# EAGLE design VU_Meter_Featherwing (EAGLE 9.5.0)
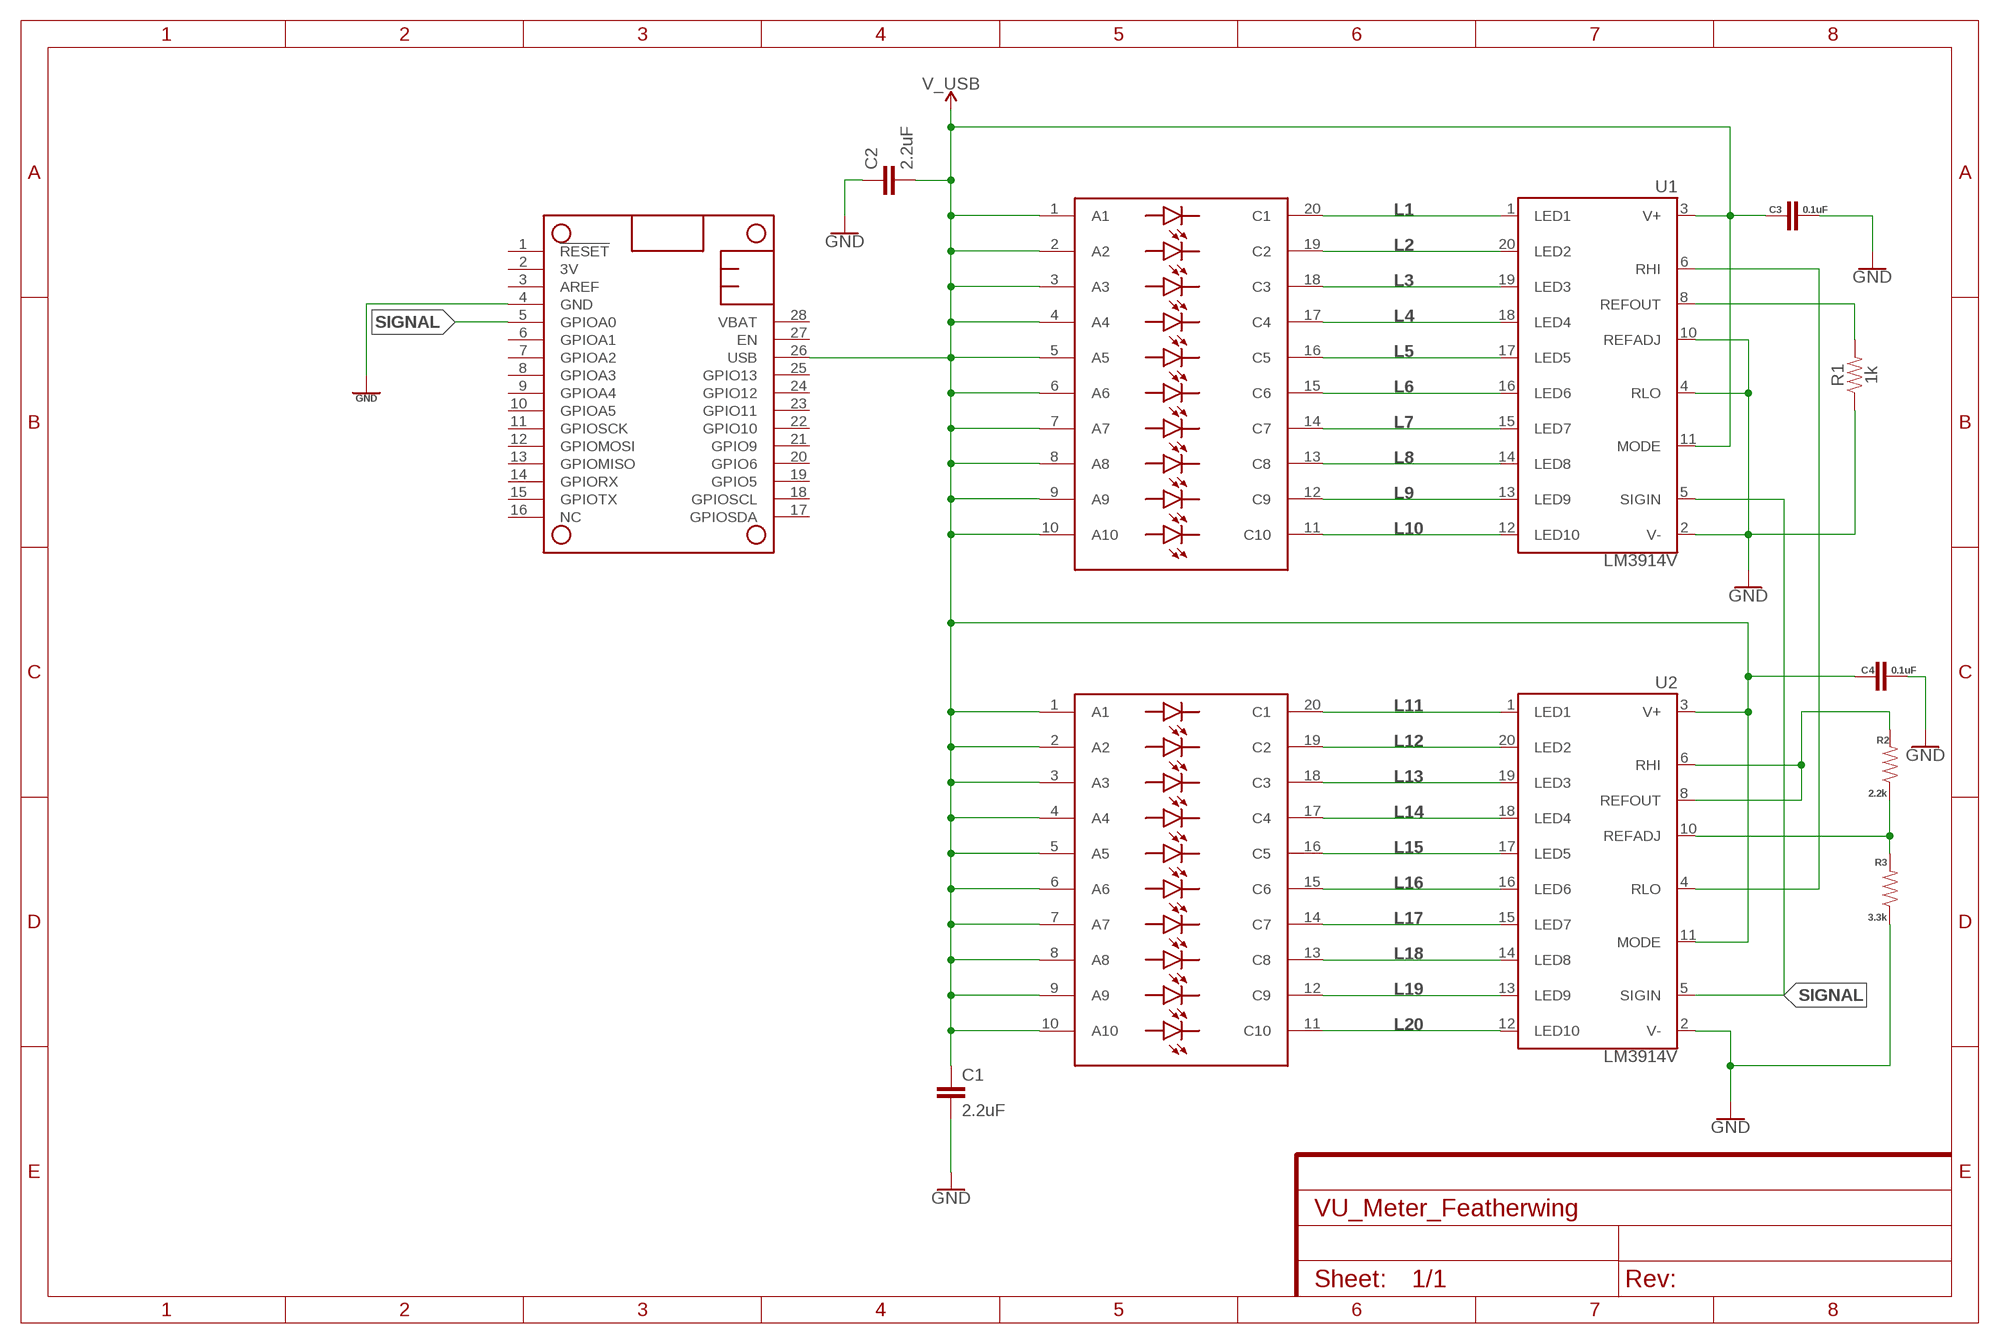
[diagram p0: schematic, sheet 1]

## Parts
C1  2.2uF  2.2UF-0603-10V-20%  [0603]
C2  2.2uF  2.2UF-0603-10V-20%  [0603]
C3  0.1uF  0.1UF-0603-25V-(+80/-20%)  [0603]
C4  0.1uF  0.1UF-0603-25V-(+80/-20%)  [0603]
MS1  FEATHERWINGBAR_GRAPH  [FEATHERWING_BAR]
R1  1k  1KOHM-0603-1/10W-1%  [0603]
R2  2.2k  2.2KOHM-0603-1/10W-1%  [0603]
R3  3.3k  3.3KOHM-0603-1/10W-1%  [0603]
U1  LM3914V  [PLCC20S]
U2  LM3914V  [PLCC20S]
U$1  BAR_GRAPHSMD-BARGRAPH  [3104310541105000]
U$2  BAR_GRAPHSMD-BARGRAPH  [3104310541105000]

## Nets
GND: C1.2 C2.1 C3.2 C4.2 MS1.4(GND) R1.1 R3.1 U1.2(V-) U1.4(RLO) U1.10(REFADJ) U2.2(V-)
L1: U1.1(LED1) U$1.20(C1)
L2: U1.20(LED2) U$1.19(C2)
L3: U1.19(LED3) U$1.18(C3)
L4: U1.18(LED4) U$1.17(C4)
L5: U1.17(LED5) U$1.16(C5)
L6: U1.16(LED6) U$1.15(C6)
L7: U1.15(LED7) U$1.14(C7)
L8: U1.14(LED8) U$1.13(C8)
L9: U1.13(LED9) U$1.12(C9)
L10: U1.12(LED10) U$1.11(C10)
L11: U2.1(LED1) U$2.20(C1)
L12: U2.20(LED2) U$2.19(C2)
L13: U2.19(LED3) U$2.18(C3)
L14: U2.18(LED4) U$2.17(C4)
L15: U2.17(LED5) U$2.16(C5)
L16: U2.16(LED6) U$2.15(C6)
L17: U2.15(LED7) U$2.14(C7)
L18: U2.14(LED8) U$2.13(C8)
L19: U2.13(LED9) U$2.12(C9)
L20: U2.12(LED10) U$2.11(C10)
N$2: R1.2 U1.8(REFOUT)
N$4: R2.1 R3.2 U2.10(REFADJ)
N$5: R2.2 U2.6(RHI) U2.8(REFOUT)
REF: U1.6(RHI) U2.4(RLO)
SIGNAL: MS1.5(GPIOA0) U1.5(SIGIN) U2.5(SIGIN)
V_USB: C1.1 C2.2 C3.1 C4.1 MS1.26(USB) U1.3(V+) U1.11(MODE) U2.3(V+) U2.11(MODE) U$1.1(A1) U$1.2(A2) U$1.3(A3) U$1.4(A4) U$1.5(A5) U$1.6(A6) U$1.7(A7) U$1.8(A8) U$1.9(A9) U$1.10(A10) U$2.1(A1) U$2.2(A2) U$2.3(A3) U$2.4(A4) U$2.5(A5) U$2.6(A6) U$2.7(A7) U$2.8(A8) U$2.9(A9) U$2.10(A10)
Unconnected: MS1.1(!RESET) MS1.2(3V) MS1.3(AREF) MS1.6(GPIOA1) MS1.7(GPIOA2) MS1.8(GPIOA3) MS1.9(GPIOA4) MS1.10(GPIOA5) MS1.11(GPIOSCK) MS1.12(GPIOMOSI) MS1.13(GPIOMISO) MS1.14(GPIORX) MS1.15(GPIOTX) MS1.16(NC) MS1.17(GPIOSDA) MS1.18(GPIOSCL) MS1.19(GPIO5) MS1.20(GPIO6) MS1.21(GPIO9) MS1.22(GPIO10) MS1.23(GPIO11) MS1.24(GPIO12) MS1.25(GPIO13) MS1.27(EN) MS1.28(VBAT)

## Library data of the parts
C1 C2 = SparkFun-Capacitors:2.2UF: 2.2µF ceramic capacitors A capacitor is a passive two-terminal electrical component used to store electrical energy temporarily in an electric field.; PROD_ID: CAP-07888
C3 C4 = SparkFun-Capacitors:0.1UF: 0.1µF ceramic capacitors A capacitor is a passive two-terminal electrical component used to store electrical energy temporarily in an electric field.; PROD_ID: CAP-00810
MS1 = adafruit:FEATHERWING
R1 = SparkFun-Resistors:1KOHM: 1kΩ resistor A resistor is a passive two-terminal electrical component that implements electrical resistance as a circuit element. Resistors act to reduce current flow, and, at the same time, act to lower voltage levels within circuits. - Wikipedia; PROD_ID: RES-07856
R2 = SparkFun-Resistors:2.2KOHM: 2.2kΩ resistor A resistor is a passive two-terminal electrical component that implements electrical resistance as a circuit element. Resistors act to reduce current flow, and, at the same time, act to lower voltage levels within circuits. - Wikipedia; PROD_ID: RES-08272
R3 = SparkFun-Resistors:3.3KOHM: 3.3kΩ resistor A resistor is a passive two-terminal electrical component that implements electrical resistance as a circuit element. Resistors act to reduce current flow, and, at the same time, act to lower voltage levels within circuits. - Wikipedia; PROD_ID: RES-07851
U1 U2 = SparkFun-IC-Special-Function:LM391: LM3914 Dot/Bar Display Driver TTL/CMOS Logic Drives LEDs, LCDs, Vacuum Fluorecents Source: Data sheet LM3915 <http://www.national.com/ds/LM/LM3915.pdf> Data sheet LM3914 <http://www.national.com/ds/LM/LM3914.pdf> SparkFun Products: MyoWare LED Shield <https://www.sparkfun.com/products/13688> Dot/Bar Display Driver - LM3914 <https://www.sparkfun.com/products/12694>; PROD_ID: IC-13110
U$1 U$2 = bar-grph:BAR_GRAPH

## Board
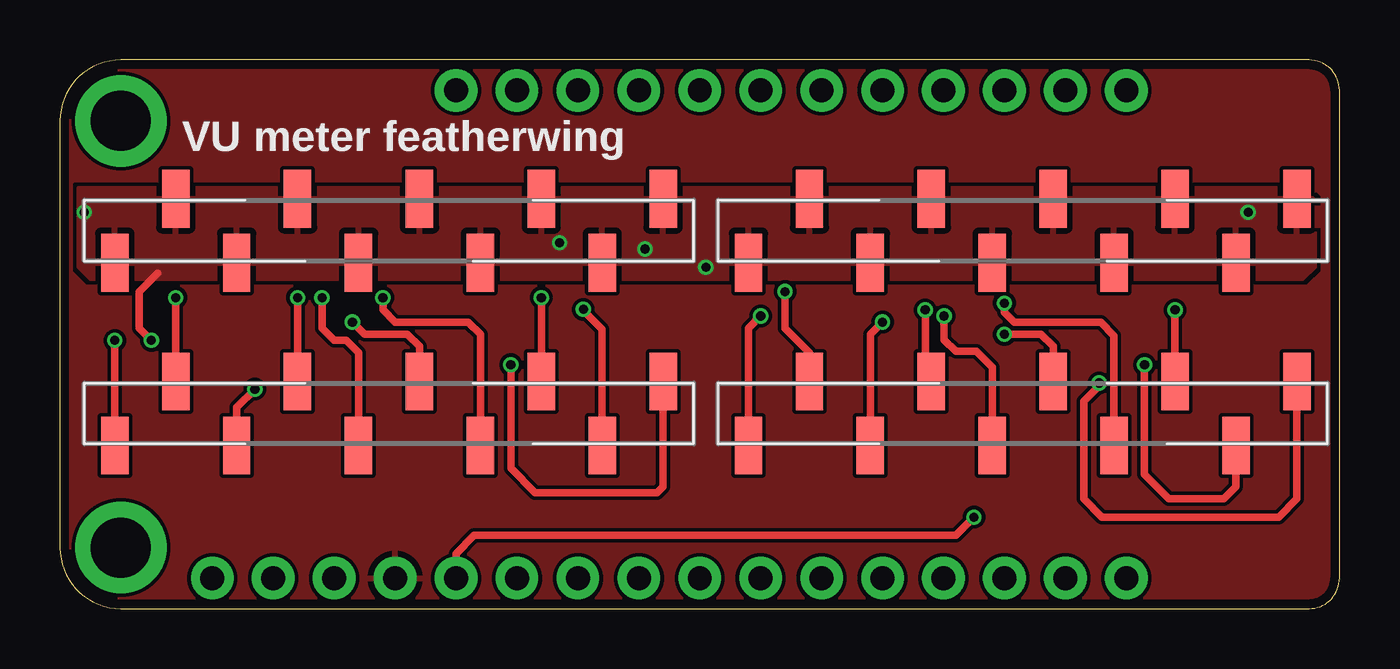
[diagram p1: board, top side]
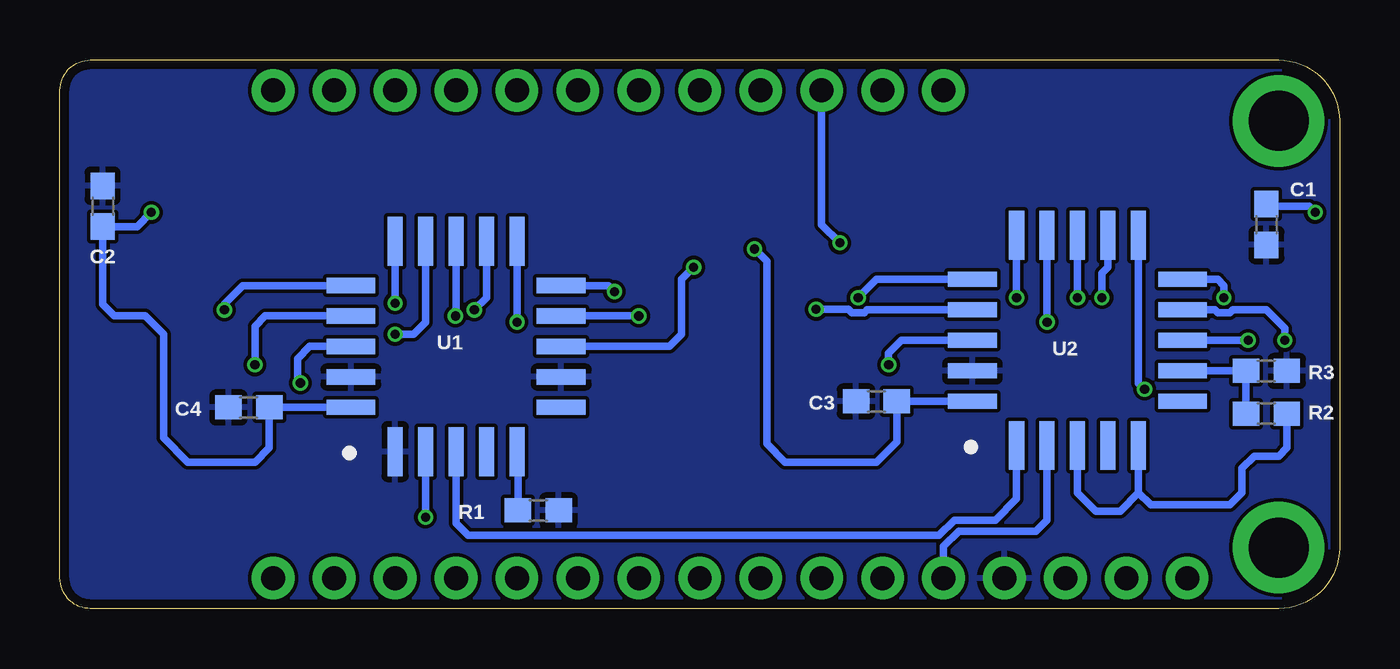
[diagram p2: board, bottom side, seen from below]

Size 53.34 x 22.86 mm. Coordinates in mm from the lower left corner, seen from the top.
Copper layers (1*16): Top 0.035559375mm / dielectric 1.6mm / Bottom 0.035559375mm
Design rules "oshpark-2layer": minimum track width 6mil, minimum drill 10mil, track to track 6mil, track to pad 6mil, pad to pad 6mil, via to via 6mil, smd to smd 6mil, copper to edge 15mil, drill to drill 6mil, minimum pad ring 5mil, minimum via ring 5mil, stop-mask expansion 2.5mil, vias tented up to drill 0mil, thermal gap 10mil

### Footprints (pad centres in the part's own frame; a part is rotated, then mirrored left to right if it is on the bottom)
0603 = smd 1.1 x 1: 1 -0.85,0; 2 0.85,0
FEATHERWING_BAR = drill 1 pad 1.778: 1 6.35,1.27; 2 8.89,1.27; 3 11.43,1.27; 4 13.97,1.27; 5 16.51,1.27; 6 19.05,1.27; 7 21.59,1.27; 8 24.13,1.27; 9 26.67,1.27; 10 29.21,1.27; 11 31.75,1.27; 12 34.29,1.27; 13 36.83,1.27; 14 39.37,1.27; 15 41.91,1.27; 16 44.45,1.27; 17 44.45,21.59; 18 41.91,21.59; 19 39.37,21.59; 20 36.83,21.59; 21 34.29,21.59; 22 31.75,21.59; 23 29.21,21.59; 24 26.67,21.59; 25 24.13,21.59; 26 21.59,21.59; 27 19.05,21.59; 28 16.51,21.59 | drill 2.5 pad 3.81: P$1 2.54,20.32; P$2 2.54,2.54
PLCC20S = smd 0.63 x 2.035: 1 0,4.383; 2 -1.27,4.383; 3 -2.54,4.383; 9 -2.54,-4.383; 10 -1.27,-4.383; 11 0,-4.383; 12 1.27,-4.383; 13 2.54,-4.383; 19 2.54,4.383; 20 1.27,4.383 | smd 2.035 x 0.63: 4 -4.383,2.54; 5 -4.383,1.27; 6 -4.383,0; 7 -4.383,-1.27; 8 -4.383,-2.54; 14 4.383,-2.54; 15 4.383,-1.27; 16 4.383,0; 17 4.383,1.27; 18 4.383,2.54
3104310541105000 = smd 2.413 x 1.143: 1 -1.334,11.43; 2 1.334,8.89; 3 -1.334,6.35; 4 1.334,3.81; 5 -1.334,1.27; 6 1.334,-1.27; 7 -1.334,-3.81; 8 1.334,-6.35; 9 -1.334,-8.89; 10 1.334,-11.43; 11 8.954,-11.43; 12 6.286,-8.89; 13 8.954,-6.35; 14 6.286,-3.81; 15 8.954,-1.27; 16 6.286,1.27; 17 8.954,3.81; 18 6.286,6.35; 19 8.954,8.89; 20 6.286,11.43

### Placement (x,y rotation side)
C1  3.05,16 270 bottom
C2  51.56,16.76 270 bottom
C3  19.3,8.64 180 bottom
C4  45.47,8.38 180 bottom
MS1  0,0 0 top
R1  33.4,4.09 180 bottom
R2  3.05,8.13 0 bottom
R3  3.05,9.91 180 bottom
U1  36.83,10.92 90 bottom
U2  10.92,11.18 90 bottom
U$1  40.13,15.75 270 top
U$2  13.72,15.75 270 top

### Tracks (layer width: path | path; a pad name or v marks a point on that pad's centre or on a via)
GND
  pour Top (rank 6): 0,0 53.34,0 53.34,22.86 0,22.86
  pour Bottom (rank 6): 0,0 0,22.86 53.34,22.86 53.34,0
L1  (via drill 0.38)
  Top 0.305: U$1.20 51.56,4.57 50.8,3.81 43.43,3.81 42.67,4.57 42.67,8.38 42.67,8.64 43.43,9.4 v43.32,9.4
  Bottom 0.305: v43.32,9.4 43.43,9.51 43.43,10.41 42.93,10.92 U1.1
L2  (via drill 0.38)
  Top 0.305: U$1.19 49.02,5.08 48.51,4.57 46.23,4.57 45.21,5.59 v45.21,10.16
  Bottom 0.305: v45.21,10.16 45.21,11.76 44.78,12.19 U1.20
L3  (via drill 0.38)
  Top 0.305: U$1.18 v46.48,12.45
  Bottom 0.305: v46.48,12.45 46.48,12.7 45.72,13.46 U1.19
L4  (via drill 0.38)
  Top 0.305: v39.37,12.72 39.37,12.34 39.78,11.94 43.38,11.94 43.94,11.38 U$1.17
  Bottom 0.305: v39.37,12.72 U1.18
L5  (via drill 0.38)
  Top 0.305: U$1.16 41.4,10.92 40.89,11.43 v39.37,11.43
  Bottom 0.305: v39.37,11.43 38.61,11.43 38.1,11.94 U1.17
L6  (via drill 0.38)
  Top 0.305: U$1.15 38.86,10.06 38.2,10.72 37.34,10.72 36.85,11.2 v36.85,12.19
  Bottom 0.305: v36.85,12.19 36.83,12.22 U1.16
L7  (via drill 0.38)
  Top 0.305: U$1.14 36.07,9.72 v36.07,12.45
  Bottom 0.305: v36.07,12.45 35.56,12.95 U1.15
L8  (via drill 0.38)
  Top 0.305: U$1.13 33.78,11.43 v34.29,11.94
  Bottom 0.305: v34.29,11.94 U1.14
L9  (via drill 0.38)
  Top 0.305: v30.23,13.21 30.23,11.68 31.24,10.67 U$1.12
  Bottom 0.305: U1.13 30.48,13.46 v30.23,13.21
L10  (via drill 0.38)
  Top 0.305: U$1.11 28.7,11.68 v29.21,12.19
  Bottom 0.305: v29.21,12.19 U1.12
L11  (via drill 0.38)
  Top 0.305: U$2.20 25.15,5.08 24.89,4.83 19.81,4.83 18.8,5.84 18.8,8.64 v18.8,10.16
  Bottom 0.305: v18.8,10.16 18.8,10.64 18.26,11.18 U2.1
L12  (via drill 0.38)
  Top 0.305: U$2.19 22.61,11.63 21.79,12.45 v21.82,12.47
  Bottom 0.305: v21.82,12.47 20.46,12.47 20.32,12.33 19.81,12.33 19.69,12.45 U2.20
L13  (via drill 0.38)
  Top 0.305: U$2.18 v20.07,12.95
  Bottom 0.305: v20.07,12.95 19.3,13.72 U2.19
L14  (via drill 0.38)
  Top 0.305: U$2.17 17.53,11.43 17.02,11.94 13.97,11.94 13.46,12.45 v13.46,12.95
  Bottom 0.305: v13.46,12.95 U2.18
L15  (via drill 0.38)
  Top 0.305: U$2.16 14.99,10.92 14.48,11.43 12.7,11.43 v12.19,11.94
  Bottom 0.305: v12.19,11.94 U2.17
L16  (via drill 0.38)
  Top 0.305: U$2.15 12.45,10.67 11.94,11.18 11.43,11.18 10.92,11.68 v10.92,12.95
  Bottom 0.305: v10.92,12.95 U2.16
L17  (via drill 0.38)
  Top 0.305: U$2.14 v9.91,12.95
  Bottom 0.305: v9.91,12.95 9.91,13.97 9.65,14.22 U2.15
L18  (via drill 0.38)
  Top 0.305: v8.13,9.14 7.37,8.38 U$2.13
  Bottom 0.305: U2.14 8.38,9.4 v8.13,9.14
L19  (via drill 0.38)
  Top 0.305: U$2.12 v4.83,12.95
  Bottom 0.305: v4.83,12.95 4.83,13.46 5.08,13.72 U2.13
L20  (via drill 0.38)
  Top 0.305: U$2.11 v2.29,11.18
  Bottom 0.305: v2.29,11.18 2.29,11.68 3.05,12.45 4.45,12.45 4.57,12.33 5.08,12.33 5.2,12.45 U2.12
N$2
  Bottom 0.305: R1.2 34.25,6.5 U1.8
N$4
  Bottom 0.305: U2.10 R3.2 R2.1
N$5
  Bottom 0.305: U2.8 8.38,4.83 | 8.38,4.83 7.87,4.32 4.57,4.32 4.06,4.83 4.06,5.84 3.56,6.35 2.54,6.35 2.2,6.69 R2.2 | U2.6 10.92,4.83 10.16,4.06 9.14,4.06 8.38,4.83
REF
  Bottom 0.305: U1.6 36.83,3.56 36.32,3.05 16.7,3.05 16.06,3.68 14.35,3.68 13.46,4.57 U2.4
SIGNAL  (via drill 0.38)
  Top 0.305: MS1.5 16.51,2.29 17.27,3.05 37.34,3.05 v38.1,3.81
  Bottom 0.305: MS1.5 16.51,2.59 15.88,3.23 12.65,3.23 12.19,3.68 U2.5 | v38.1,3.81 U1.5
V_USB  (via drill 0.38)
  Top 0.305: v3.81,11.18 3.3,11.68 3.3,13.21 4.06,13.97
  Bottom 0.305: U2.3 C3.1 18.45,6.95 19.3,6.1 23.11,6.1 23.88,6.86 23.88,14.48 v24.38,14.99 | MS1.26 21.59,16 v20.83,15.24 | U2.11 v3.81,11.18 | v49.53,16.51 50.13,15.91 C2.2 51.56,12.68 51.08,12.19 49.78,12.19 49.02,11.43 49.02,7.11 48.01,6.1 45.21,6.1 44.62,6.69 C4.1 U1.3 | U1.11 27.94,10.92 27.43,11.43 27.43,13.72 v26.92,14.22 | C1.1 2.96,16.76 1.27,16.76 v1.02,16.51
  pour Top: 0.76,17.53 51.82,17.53 52.32,17.02 52.32,14.22 51.82,13.72 1.27,13.72 0.76,14.22 0.76,16.76

### Text on the board
tNames: VU meter featherwing